# EasyEDA Pro project ProProject_运放实验_2024-09-24.epro, board PCB3
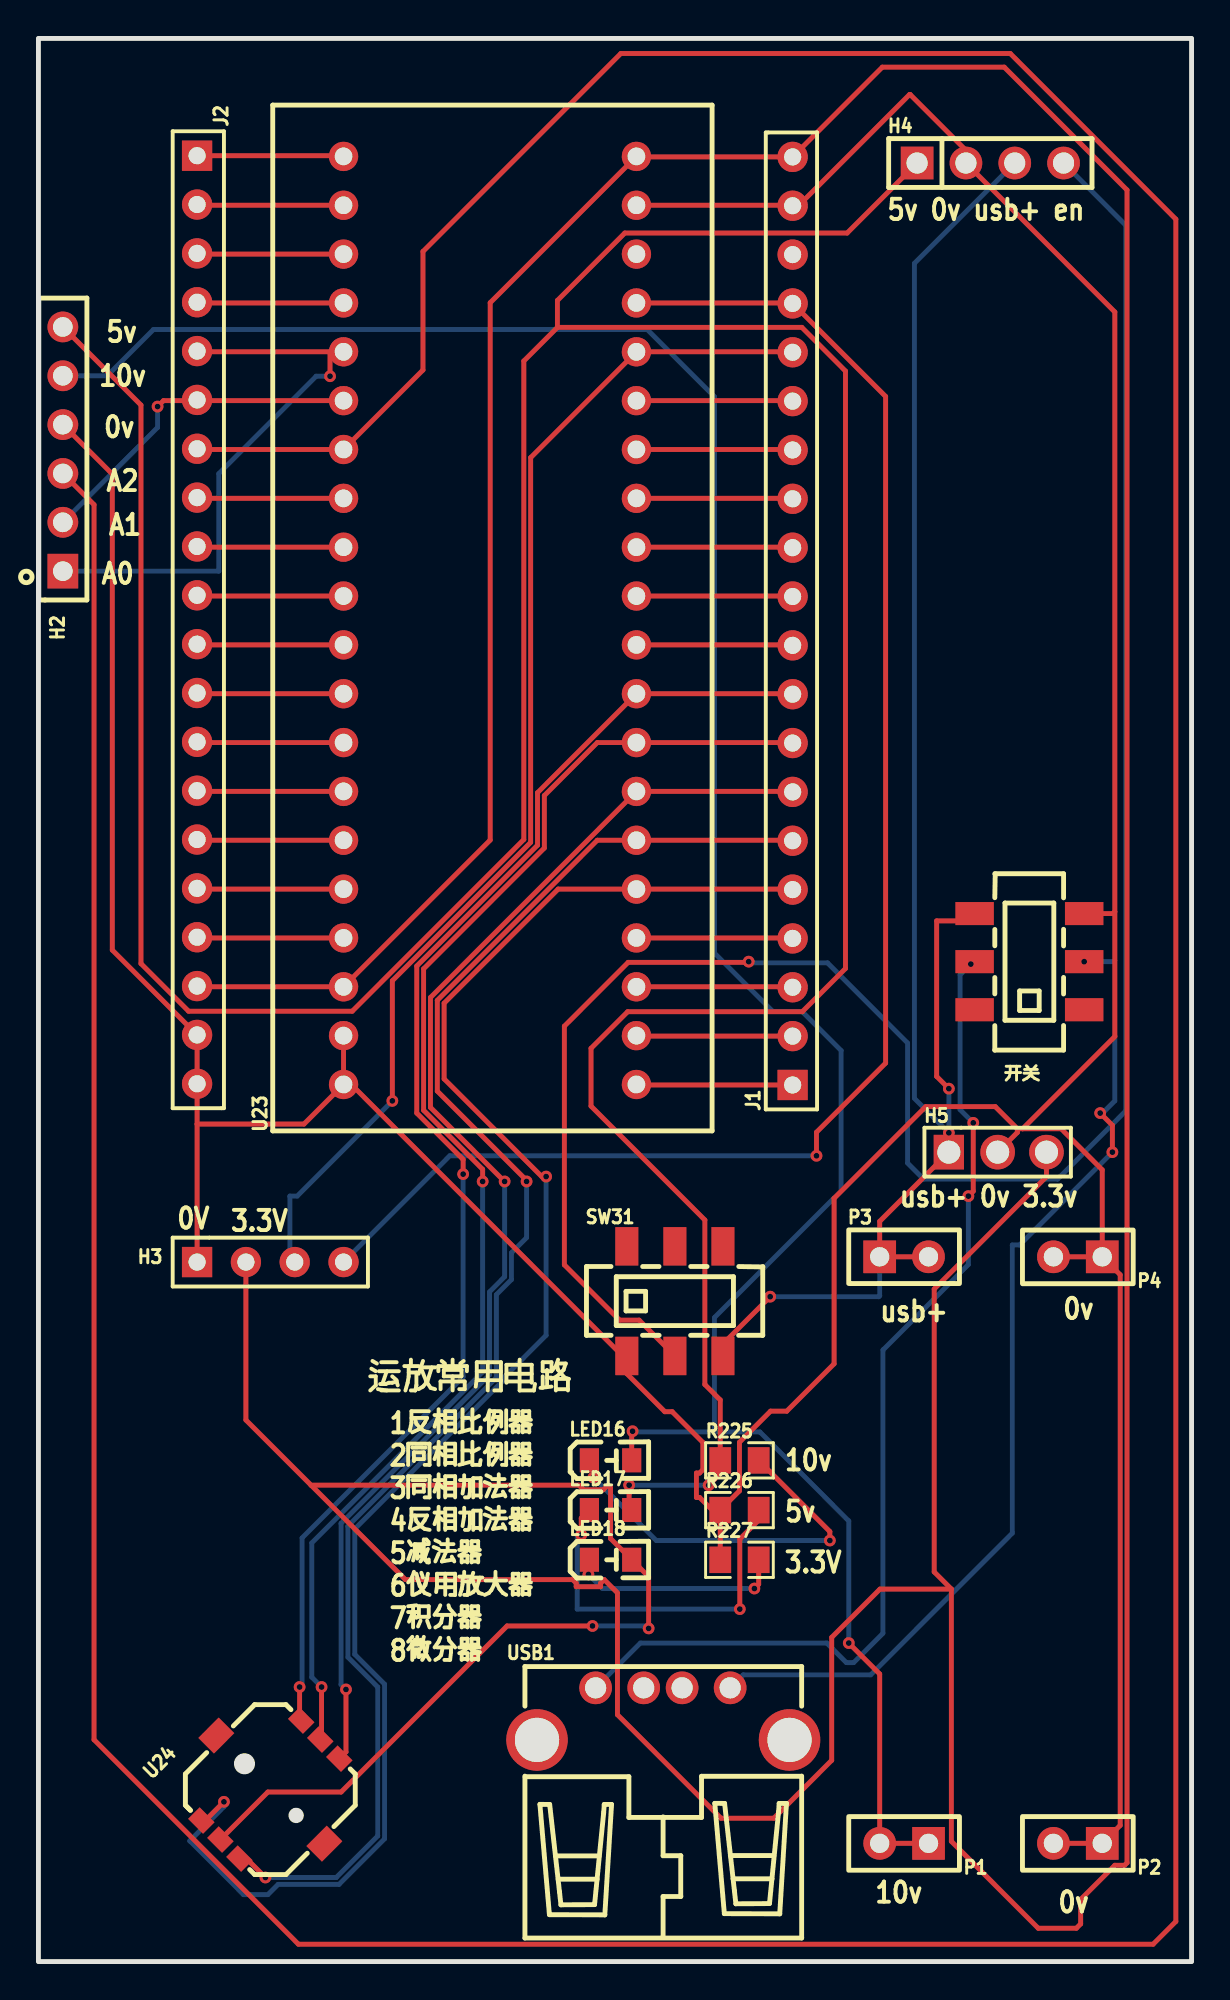
[diagram p13: board, top side]
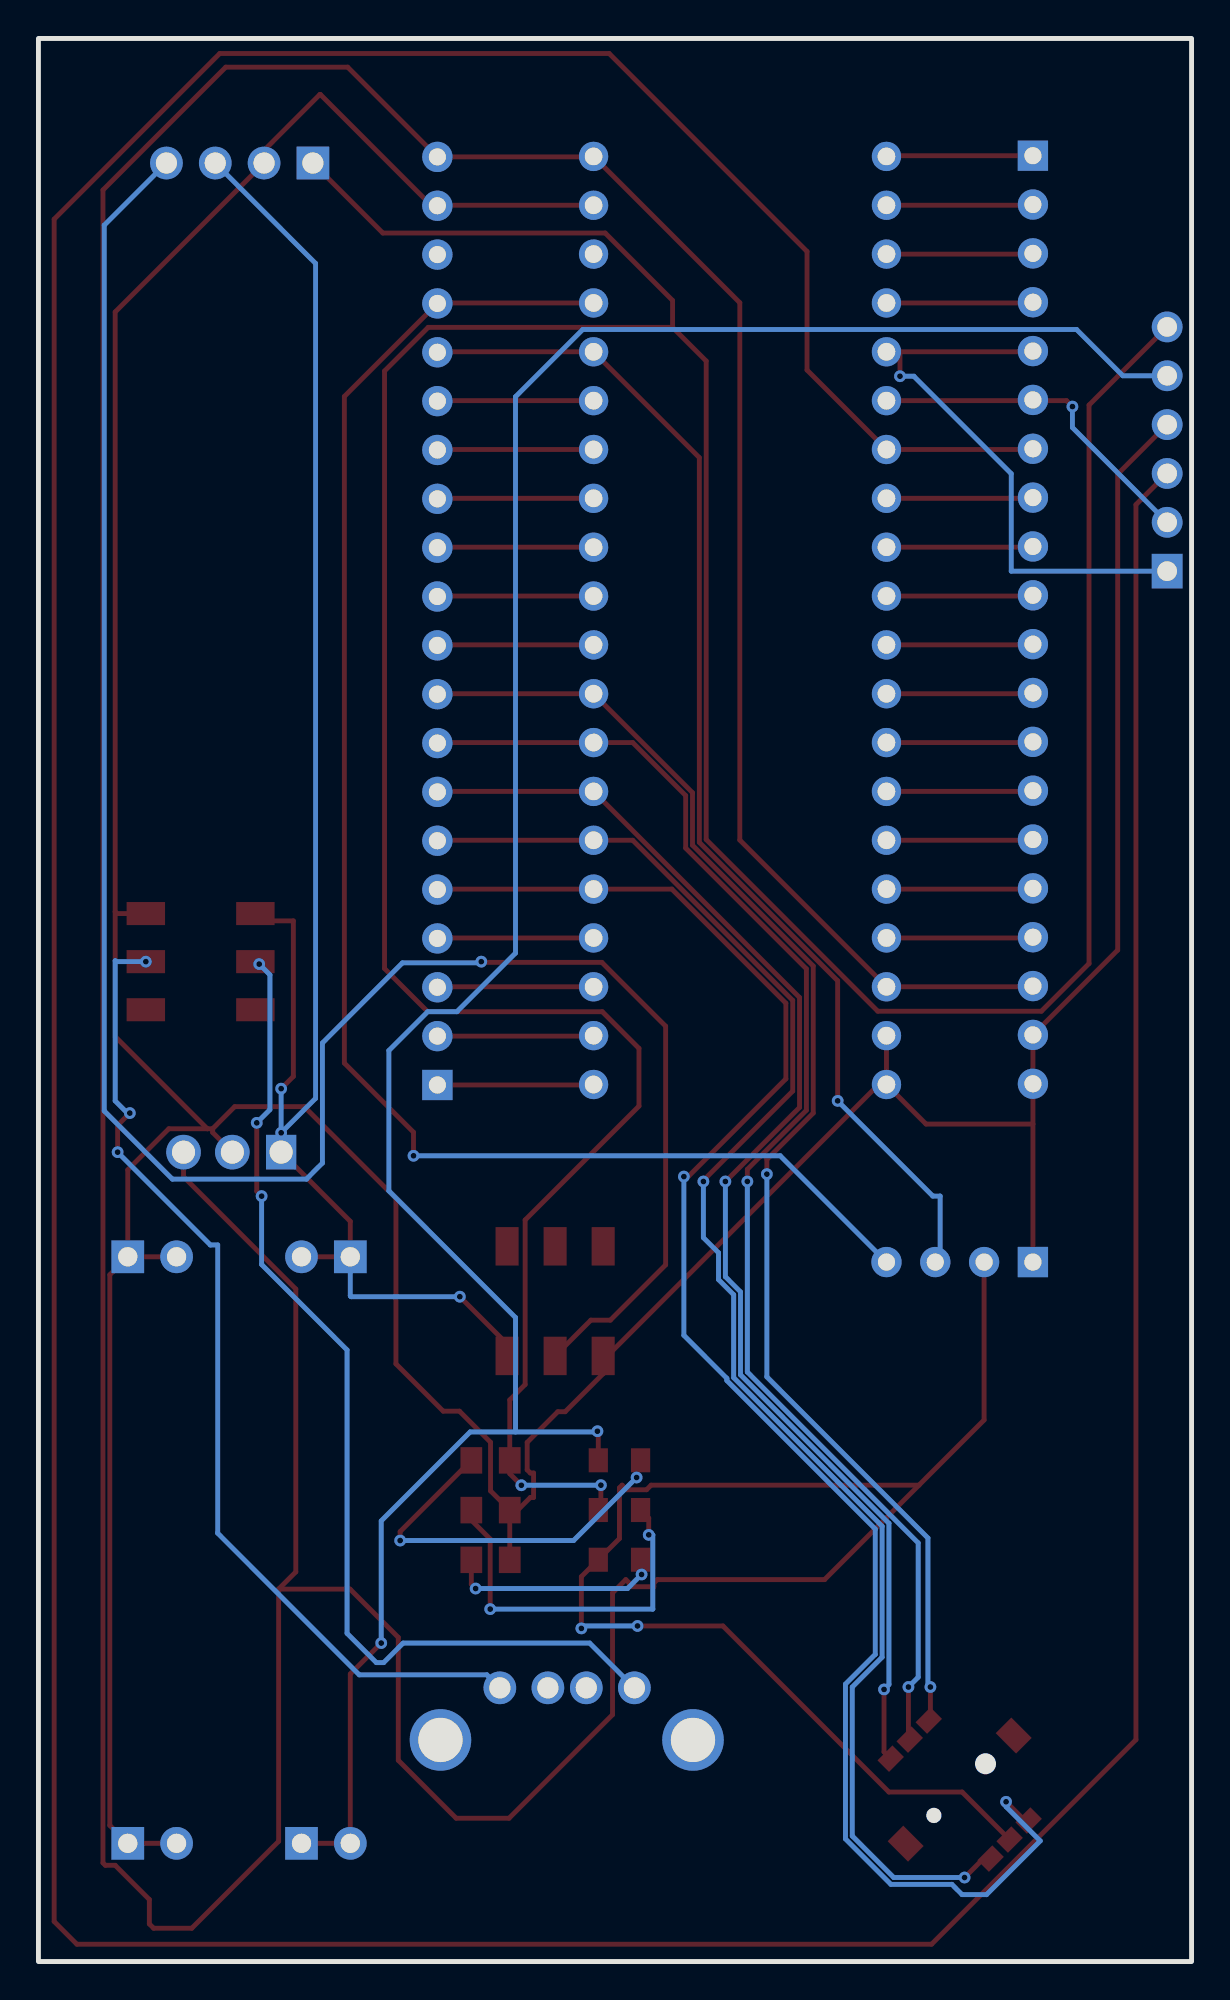
[diagram p14: board, bottom side, seen from below]

Outline 60 x 100 mm; copper layers: Top Layer, Bottom Layer. Coordinates in mm from the lower left corner of the outline.
Outline path: rectangle 0,100 60,0
Stack: Top Layer 0.035mm - / Dielectric1 1.51mm FR4 er 4.5 / Bottom Layer 0.035mm -

## Design rules (mm)
template: JLCPCB Capability(Two Layers Board)
spacing copperThickness1oz (default): track to track 0.102, other pairs 0.152 to 0.3
spacing copperThickness2oz: track to track 0.203, other pairs 0.152 to 0.3
track width copperThickness1oz (default): min 0.127, default 0.254, max 2.54
track width copperThickness2oz: min 0.203, default 0.254, max 2.54
differential pair differentialPair (default): width min 0.127, default 0.254, max 2.54; gap min 0.152, default 0.152
via viaSize (default): diameter min 0.5, default 0.61, max 10; hole min 0.3, default 0.305, max 6.3

## Placement (name value [footprint] x y rotation side)
H2  PM254V-11-06-H85  [HDR-TH_6P-P2.54-V-F]  1.27 78.65 90 top
H3  HDR-F-2.54_1x4  [HDR-F-2.54_1X4]  12.06 36.37 0 top
H4  2.54-1*4P母  [HDR-TH_4P-P2.54-V-F]  49.53 93.52 0 top
H5  2.54-1*3P针  [HDR-TH_3P-P2.54-V-M-1]  49.91 42.09 0 top
J1  HDR-M-2.54_1x20  [HDR-M-2.54_1X20]  39.24 69.71 90 top
J2  HDR-M-2.54_1x20  [HDR-M-2.54_1X20]  8.25 69.77 270 top
LED16  -  [LED_0805]  29.82 26.06 0 top
LED17  -  [LED_0805]  29.82 23.47 0 top
LED18  -  [LED_0805]  29.82 20.89 0 top
P1  2.54-1*2P母  [HDR-TH_2P-P2.54-V-F]  45.04 6.15 180 top
P2  2.54-1*2P母  [HDR-TH_2P-P2.54-V-F]  54.08 6.15 180 top
P3  2.54-1*2P母  [HDR-TH_2P-P2.54-V-F]  45.04 36.65 0 top
P4  2.54-1*2P母  [HDR-TH_2P-P2.54-V-F]  54.08 36.65 180 top
R225  1k  [R0805]  36.48 26.06 0 top
R226  1k  [R0805]  36.48 23.47 0 top
R227  1k  [R0805]  36.48 20.89 0 top
SW31  MST22D18G2  [SW-SMD_MST22D18G2]  33.12 34.34 0 top
U23  STM32最小系统-fh  [STM32最小系统板]  22.99 69.74 90 top
U24  GT-TCA06F-H050-L1  [KEY-SMD_GT-TCA06F-H050-L1]  12.06 8.94 45 top
USB1  AF 90° WJDG  [USB-A-TH_AF-WJDG]  32.51 12.88 0 top
开关  MST22D18G2  [SW-SMD_MST22D18G2]  51.56 51.99 90 top

## Footprints (pads in the part's own frame, mm; a bottom-side part is the same pattern mirrored in y, then rotated)
HDR-F-2.54_1X4
  rect 1.575x1.575 hole 0.889: 1(-3.81,0)
  round 1.575 hole 0.889: 2(-1.27,0) 3(1.27,0) 4(3.81,0)
HDR-M-2.54_1X20
  rect 1.575x1.575 hole 0.889: 1(-24.13,0)
  round 1.575 hole 0.889: 2(-21.59,0) 3(-19.05,0) 4(-16.51,0) 5(-13.97,0) 6(-11.43,0) 7(-8.89,0) 8(-6.35,0) 9(-3.81,0) 10(-1.27,0) 11(1.27,0) 12(3.81,0) 13(6.35,0) 14(8.89,0) 15(11.43,0) 16(13.97,0) 17(16.51,0) 18(19.05,0) 19(21.59,0) 20(24.13,0)
HDR-TH_2P-P2.54-V-F
  rect 1.7x1.7 hole 1: 1(-1.27,0)
  round 1.7 hole 1: 2(1.27,0)
HDR-TH_3P-P2.54-V-M-1
  rect 1.575x1.8 hole 1.2: 1(-2.54,0)
  round 1.8 hole 1.2: 2(0,0) 3(2.54,0)
HDR-TH_4P-P2.54-V-F
  rect 1.7x1.7 hole 1.1: 1(-3.81,0)
  round 1.7 hole 1.1: 2(-1.27,0) 3(1.27,0) 4(3.81,0)
HDR-TH_6P-P2.54-V-F
  rect 1.8x1.6 hole 1.02: 1(-6.35,0)
  round 1.6 hole 1.02: 2(-3.81,0) 3(-1.27,0) 4(1.27,0) 5(3.81,0) 6(6.35,0)
KEY-SMD_GT-TCA06F-H050-L1
  rect 0.85x1.1 smd: 1(-3.675,1.4) 2(-3.675,0) 3(-3.675,-1.4) 4(3.675,1.4) 5(3.675,0) 6(3.675,-1.4)
  rect 1.5x1.15 smd: 7(0,3.975) 8(0,-3.975)
LED_0805
  rect 1x1.25 smd: 1(-1.15,0.005) 2(1.05,0.005)
R0805
  rect 1.133x1.377 smd: 1(-1,0) 2(1,0)
STM32最小系统板
  round 1.524 hole 0.919x0.914: 1(-24.13,7.112) 2(-21.59,7.112) 3(-19.05,7.112) 4(-16.51,7.112) 5(-13.97,7.112) 6(-11.43,7.112) 7(-8.89,7.112) 8(-6.35,7.112) 9(-3.81,7.112) 10(-1.27,7.112) 11(1.27,7.112) 12(3.81,7.112) 13(6.35,7.112) 14(8.89,7.112) 15(11.43,7.112) 16(13.97,7.112) 17(16.51,7.112) 18(19.05,7.112) 19(21.59,7.112) 20(24.13,7.112) 21(24.13,-8.128) 22(21.59,-8.128) 23(19.05,-8.128) 24(16.51,-8.128) 25(13.97,-8.128) 26(11.43,-8.128) 27(8.89,-8.128) 28(6.35,-8.128) 29(3.81,-8.128) 30(1.27,-8.128) 31(-1.27,-8.128) 32(-3.81,-8.128) 33(-6.35,-8.128) 34(-8.89,-8.128) 35(-11.43,-8.128) 36(-13.97,-8.128) 37(-16.51,-8.128) 38(-19.05,-8.128) 39(-21.59,-8.128) 40(-24.13,-8.128)
SW-SMD_MST22D18G2
  rect 1.2x2 smd: 1(-2.5,2.85) 2(0,2.85) 3(2.5,2.85) 4(-2.5,-2.85) 5(0,-2.85) 6(2.5,-2.85)
USB-A-TH_AF-WJDG
  round 1.7 hole 1.1: 1(-3.521,1.355) 2(-1.018,1.355) 3(0.981,1.355) 4(3.48,1.355)
  round 3.2 hole 2.3: 5(-6.57,-1.355) 5(6.57,-1.355)

## Nets
As in the schematic, except:
B_0V: H2.4 H3.1 H4.2 H5.2 J1.19 J2.19 J2.20 P2.1 P2.2 P4.1 P4.2 R226.1 R227.1 SW31.4 U23.1 U23.2 U23.22 开关.6
USB+: H4.3 H5.1 P3.1 P3.2 SW31.6 开关.3
$1N33267: USB1.1 开关.2
$1N33272: USB1.4 开关.5

Pads without a net: J1 18; SW31 1 2 3; U23 23; U24 7 8; USB1 2 3 5; 开关 1 4

## Via types
v1: diameter 0.61, hole 0.305, Top Layer to Bottom Layer, 36 vias

## Routing (per net, layer and track width the routed paths; a pad name or vN(x,y) marks a point on that pad's centre or on a via; arc(x,y) is an arc through that point)
A0: length 30
  Top Layer w0.254: U23.16 15.17,83.71 ; 15.17,83.71 8.29,83.71 J2.5 ; 15.17,83.71 v1(15.17,82.44)
  Bottom Layer w0.254: H2.1 9.38,72.3 9.38,77.37 14.45,82.44 v1(15.17,82.44)
A1: length 17.9
  Top Layer w0.254: v1(6.2,80.86) 6.51,81.17 8.25,81.17 ; 8.25,81.17 U23.15 ; 8.25,81.17 J2.6
  Bottom Layer w0.254: H2.2 6.2,79.77 v1(6.2,80.86)
A2: length 282.9
  Top Layer w0.254: H2.3 2.89,75.76 2.89,11.53 13.53,0.9 58,0.9 59.18,2.08 59.18,90.6 50.57,99.22 30.3,99.22 20.01,88.92 20.01,82.76 U23.14 8.29,78.63 J2.7
A3: length 7.6
  Top Layer w0.254: J2.8 8.29,76.09 15.88,76.09
A4: length 7.6
  Top Layer w0.254: U23.12 8.29,73.55 J2.9
A5: length 7.6
  Top Layer w0.254: 15.88,71.01 8.29,71.01 J2.10
A6: length 7.6
  Top Layer w0.254: J2.11 8.29,68.47 U23.10
A7: length 7.6
  Top Layer w0.254: J2.12 8.29,65.93 15.88,65.93
A8: length 88
  Top Layer w0.254: v1(26.42,40.82) 26.19,40.82 21.11,45.9 21.11,49.83 27.04,55.77 U23.36 39.22,55.77 J1.5 ; U24.1 8.68,7.33 v1(9.65,8.31)
  Bottom Layer w0.254: v1(9.65,8.31) 9.65,8.05 7.87,6.27 10.67,3.48 11.94,3.48 12.47,4.01 15.64,4.01 18.01,6.38 18.01,14.42 16.46,15.97 16.46,22.49 24.18,30.22 24.18,30.33 26.42,32.56 v1(26.42,40.82)
A9: length 80.3
  Top Layer w0.254: v1(25.4,40.56) 25.4,40.62 20.75,45.26 20.75,49.98 29.08,58.31 39.22,58.31 J1.6 ; U24.3 10.83,5.35 v1(11.81,4.37)
  Bottom Layer w0.254: v1(11.81,4.37) 15.49,4.37 17.65,6.53 17.65,14.28 16.1,15.83 16.1,22.64 23.83,30.36 23.83,34.68 24.61,35.46 24.61,36.86 25.4,37.64 v1(25.4,40.56)
A10: length 68.3
  Top Layer w0.254: v1(24.26,40.56) 24.25,40.56 20.4,44.42 20.4,50.13 U23.34 39.22,60.85 J1.7 ; U24.6 16,10.9 v1(16,14.15)
  Bottom Layer w0.254: v1(16,14.15) 15.75,14.4 15.75,22.79 23.47,30.51 23.47,34.82 24.26,35.61 v1(24.26,40.56)
A11: length 71
  Top Layer w0.254: J1.8 39.22,63.39 U23.33 29.08,63.39 26.32,60.63 ; U24.5 14.73,11.61 v1(14.73,14.28) ; v1(23.11,40.56) 23.11,41.19 20.04,44.27 20.04,51.62 26.32,57.9 26.32,60.63
  Bottom Layer w0.254: v1(14.73,14.28) 14.22,14.78 14.22,21.77 23.11,30.66 v1(23.11,40.56)
A12: length 70.8
  Top Layer w0.254: v1(22.1,40.94) 22.1,41.71 19.69,44.12 19.69,51.77 25.97,58.05 25.97,60.78 31.12,65.93 39.22,65.93 J1.9 ; v1(13.59,14.28) 13.59,12.61 U24.4
  Bottom Layer w0.254: v1(13.59,14.28) 13.72,14.4 13.72,22.02 22.1,30.4 v1(22.1,40.94)
A15: length 8.1
  Top Layer w0.254: U23.31 39.22,68.47 J1.10
B0: length 7.6
  Top Layer w0.254: J2.13 8.29,63.39 U23.8
B1: length 7.6
  Top Layer w0.254: J2.14 8.29,60.85 U23.7
B3: length 8.1
  Top Layer w0.254: J1.11 39.22,71.01 31.12,71.01
B4: length 8.1
  Top Layer w0.254: U23.29 39.22,73.55 J1.12
B5: length 8.1
  Top Layer w0.254: J1.13 39.22,76.09 31.12,76.09
B6: length 8.1
  Top Layer w0.254: U23.27 39.22,78.63 J1.14
B7: length 8.1
  Top Layer w0.254: U23.26 39.22,81.17 J1.15
B8: length 63.3
  Top Layer w0.254: v1(18.41,44.75) 18.41,51 25.61,58.2 25.61,78.2 U23.25 39.22,83.71 J1.16
  Bottom Layer w0.254: H3.3 13.08,36.63 13.08,39.8 13.46,39.8 v1(18.41,44.75)
B9: length 82.9
  Top Layer w0.254: v1(40.48,41.9) 40.48,43.12 44.08,46.72 44.08,81.38 J1.17 39.22,86.25 U23.24
  Bottom Layer w0.254: H3.4 21.4,41.9 v1(40.48,41.9)
B10: length 7.6
  Top Layer w0.254: 15.88,58.31 8.29,58.31 J2.15
B11: length 7.6
  Top Layer w0.254: J2.16 8.29,55.77 U23.5
B12: length 8.1
  Top Layer w0.254: U23.40 31.14,45.58 J1.1
B13: length 8.1
  Top Layer w0.254: 31.12,48.15 31.14,48.12 J1.2
B14: length 8.1
  Top Layer w0.254: J1.3 39.22,50.69 U23.38
B15: length 8.1
  Top Layer w0.254: J1.4 39.22,53.23 31.12,53.23
B_0V: length 249
  Top Layer w0.254: H2.4 3.84,77.35 3.84,52.59 J2.19 J2.20 8.25,43.55 ; U23.22 39.24,91.33 ; 39.24,91.33 39.57,91.33 45.33,97.09 45.35,97.09 48.26,94.18 H4.2 56.01,85.78 56.01,54.59 ; 39.24,91.33 J1.19 ; H5.2 50.94,43.11 50.94,43.31 ; 8.25,43.55 13.82,43.55 U23.1 ; 8.25,43.55 H3.1 ; P2.2 P2.1 56.29,7.08 56.29,35.71 P4.1 ; 51.21,43.31 56.01,48.1 56.01,54.59 ; 51.21,43.31 50.94,43.31 ; 51.21,43.31 53.22,43.31 55.35,41.17 P4.1 ; 56.01,54.59 55.91,54.49 开关.6 ; U23.1 15.88,48.15 ; U23.1 16.28,45.61 30.4,31.49 30.62,31.49 30.62,30.57 32.59,28.59 32.98,28.59 34.57,27 34.57,25.57 34.4,25.4 34.24,25.4 34.24,24.13 34.4,24.13 35.06,23.47 R226.1 ; P4.1 P4.2 ; 50.94,43.31 49.79,44.45 46.17,44.45 41.4,39.69 41.4,31.08 38.94,28.62 38.09,28.62 36.48,27 36.48,24.47 R226.1 ; R226.1 R227.1
B_3.3V: length 343.3
  Top Layer w0.254: 14.18,24.77 19.09,19.86 27.8,19.86 27.98,19.68 27.98,19.49 29.25,19.49 29.25,19.68 29.44,19.86 30.13,19.17 30.13,12.84 35.51,7.45 38.26,7.45 41.28,10.46 41.28,16.85 43.79,19.37 47.5,19.37 ; 14.18,24.77 10.79,28.16 H3.2 ; 14.18,24.77 28.12,24.77 28.36,24.53 29.39,24.53 29.63,24.77 29.77,24.63 29.77,21.99 LED18.2 31.75,20.01 v1(31.75,17.32) ; 47.5,19.37 47.5,6.25 52.02,1.73 54,1.73 54.23,1.96 54.23,3.23 56.01,5 56.51,5 56.64,5.13 56.64,92.12 50.25,98.51 43.91,98.51 J1.20 31.14,93.84 31.12,93.87 23.51,86.26 23.51,58.32 U23.3 8.29,50.69 J2.18 ; 47.5,19.37 46.61,20.26 46.61,34.97 52.45,40.81 H5.3 ; v1(28.83,17.45) 24.38,17.45 15.75,8.81 11.94,8.81 U24.2
  Bottom Layer w0.254: v1(31.75,17.32) 31.62,17.45 v1(28.83,17.45)
B_5V: length 203.1
  Top Layer w0.254: v1(30.73,24.77) 30.73,23.61 LED17.2 ; 27,84.98 27,86.38 30.51,89.88 42.08,89.88 H4.1 ; 27,84.98 39.72,84.98 41.99,82.7 41.99,51.64 39.75,49.39 30.66,49.39 28.75,47.49 28.75,44.48 34.68,38.56 34.68,30 35.48,29.2 R225.1 35.48,25.37 v1(34.87,24.77) ; 27,84.98 25.25,83.23 25.25,58.34 16.33,49.42 7.81,49.42 5.33,51.89 5.33,80.94 H2.6
  Bottom Layer w0.254: v1(30.73,24.77) 30.74,24.77 v1(34.87,24.77)
B_10V: length 131.2
  Top Layer w0.254: LED16.2 30.87,27.53 v1(30.91,27.58) ; P1.1 P1.2 43.77,14.95 v1(42.16,16.56)
  Bottom Layer w0.254: 35.18,27.54 37.54,27.54 42.16,22.91 v1(42.16,16.56) ; 35.18,27.54 30.95,27.54 v1(30.91,27.58) ; 35.18,27.54 35.18,33.49 41.77,40.08 41.77,47.37 39.75,49.39 38.22,49.39 35.18,52.44 35.18,81.37 31.68,84.86 5.98,84.86 3.58,82.46 H2.5
C13: length 7.6
  Top Layer w0.254: U23.19 8.29,91.33 J2.2
C14: length 7.6
  Top Layer w0.254: U23.18 8.29,88.79 J2.3
C15: length 7.6
  Top Layer w0.254: J2.4 8.29,86.25 U23.17
RST: length 7.6
  Top Layer w0.254: J2.17 8.29,53.23 15.88,53.23
USB+: length 89.1
  Top Layer w0.254: P3.2 P3.1 43.77,38.49 H5.1 v1(47.37,43.09) ; 开关.3 48.33,54.11 46.74,54.11 46.74,46.03 v1(47.37,45.39) ; 35.62,31.49 35.62,32.11 v1(38.07,34.57)
  Bottom Layer w0.254: v1(47.37,45.39) v1(47.37,43.09) 45.58,44.89 45.58,88.3 H4.3 ; v1(38.07,34.57) 43.73,34.57 43.77,34.61 P3.1
VBT: length 7.6
  Top Layer w0.254: 15.88,93.87 15.84,93.9 J2.1
$1N26687: length 20.3
  Top Layer w0.254: v1(28.88,25.17) 28.88,25.86 LED16.1 ; R225.2 41.18,22.36 v1(41.18,21.89)
  Bottom Layer w0.254: v1(28.88,25.17) 32.15,21.89 v1(41.18,21.89)
$1N26764: length 19.6
  Top Layer w0.254: v1(28.25,22.19) 28.25,23.06 LED17.1 ; v1(36.49,18.33) 36.49,21.97 37.48,22.95 R226.2
  Bottom Layer w0.254: v1(28.25,22.19) 28.03,22.19 28.03,18.33 v1(36.49,18.33)
$1N26843: length 11.3
  Top Layer w0.254: LED18.1 28.67,20.18 v1(28.62,20.13) ; R227.2 37.48,19.62 v1(37.25,19.4)
  Bottom Layer w0.254: v1(28.62,20.13) 29.35,19.4 v1(37.25,19.4)
$1N32503: length 111.2
  Top Layer w0.254: 33.12,31.49 31.25,33.35 30.24,33.35 27.37,36.23 27.37,48.64 30.68,51.96 36.92,51.96 v1(36.96,51.99)
  Bottom Layer w0.254: v1(36.96,51.99) 37.02,51.93 41.06,51.93 45.22,47.77 45.22,41.52 46.06,40.69 53.03,40.69 56.58,44.23 56.58,90.29 H4.4
$1N33267: length 54.5
  Top Layer w0.254: v1(48.51,51.87) 48.59,51.87 开关.2 ; v1(48.39,39.8) 48.64,40.06 v1(48.64,43.61)
  Bottom Layer w0.254: v1(48.39,39.8) 48.39,36.25 43.94,31.8 43.94,17.07 42.42,15.54 42.04,15.54 41.02,16.56 31.32,16.56 USB1.1 ; v1(48.51,51.87) 47.96,51.31 47.96,44.3 v1(48.64,43.61)
$1N33272: length 52.4
  Top Layer w0.254: v1(55.88,42.09) 55.88,43.48 v1(55.25,44.12)
  Bottom Layer w0.254: v1(55.25,44.12) 55.37,44.12 56.01,44.75 56.01,52.04 55.96,51.99 v1(54.41,51.99) ; v1(55.88,42.09) 51.05,37.26 50.67,37.26 50.67,22.28 43.31,14.91 36.67,14.91 USB1.4

## Copper pours and planes (outline as drawn; the poured copper is in the pictures)
B_0V on Top Layer: 5.33,99.24 54.88,99.24 54.88,0.9 5.33,0.9
B_0V on Bottom Layer: 5.33,99.24 54.88,99.24 54.88,0.9 5.33,0.9

## Text on the board
Top Silkscreen Layer: 10v | A0 | 0v | 5v | A2 | A1 | 0V | 3.3V | usb+ | 5v 0v usb+ en | usb+ 0v 3.3v | 1反相比例器 / 2同相比例器 / 3同相加法器 / 4反相加法器 / 5减法器 / 6仪用放大器 / 7积分器 / 8微分器 | 运放常用电路
